# EAGLE design mailboxNotifier (EAGLE 9.4.1)
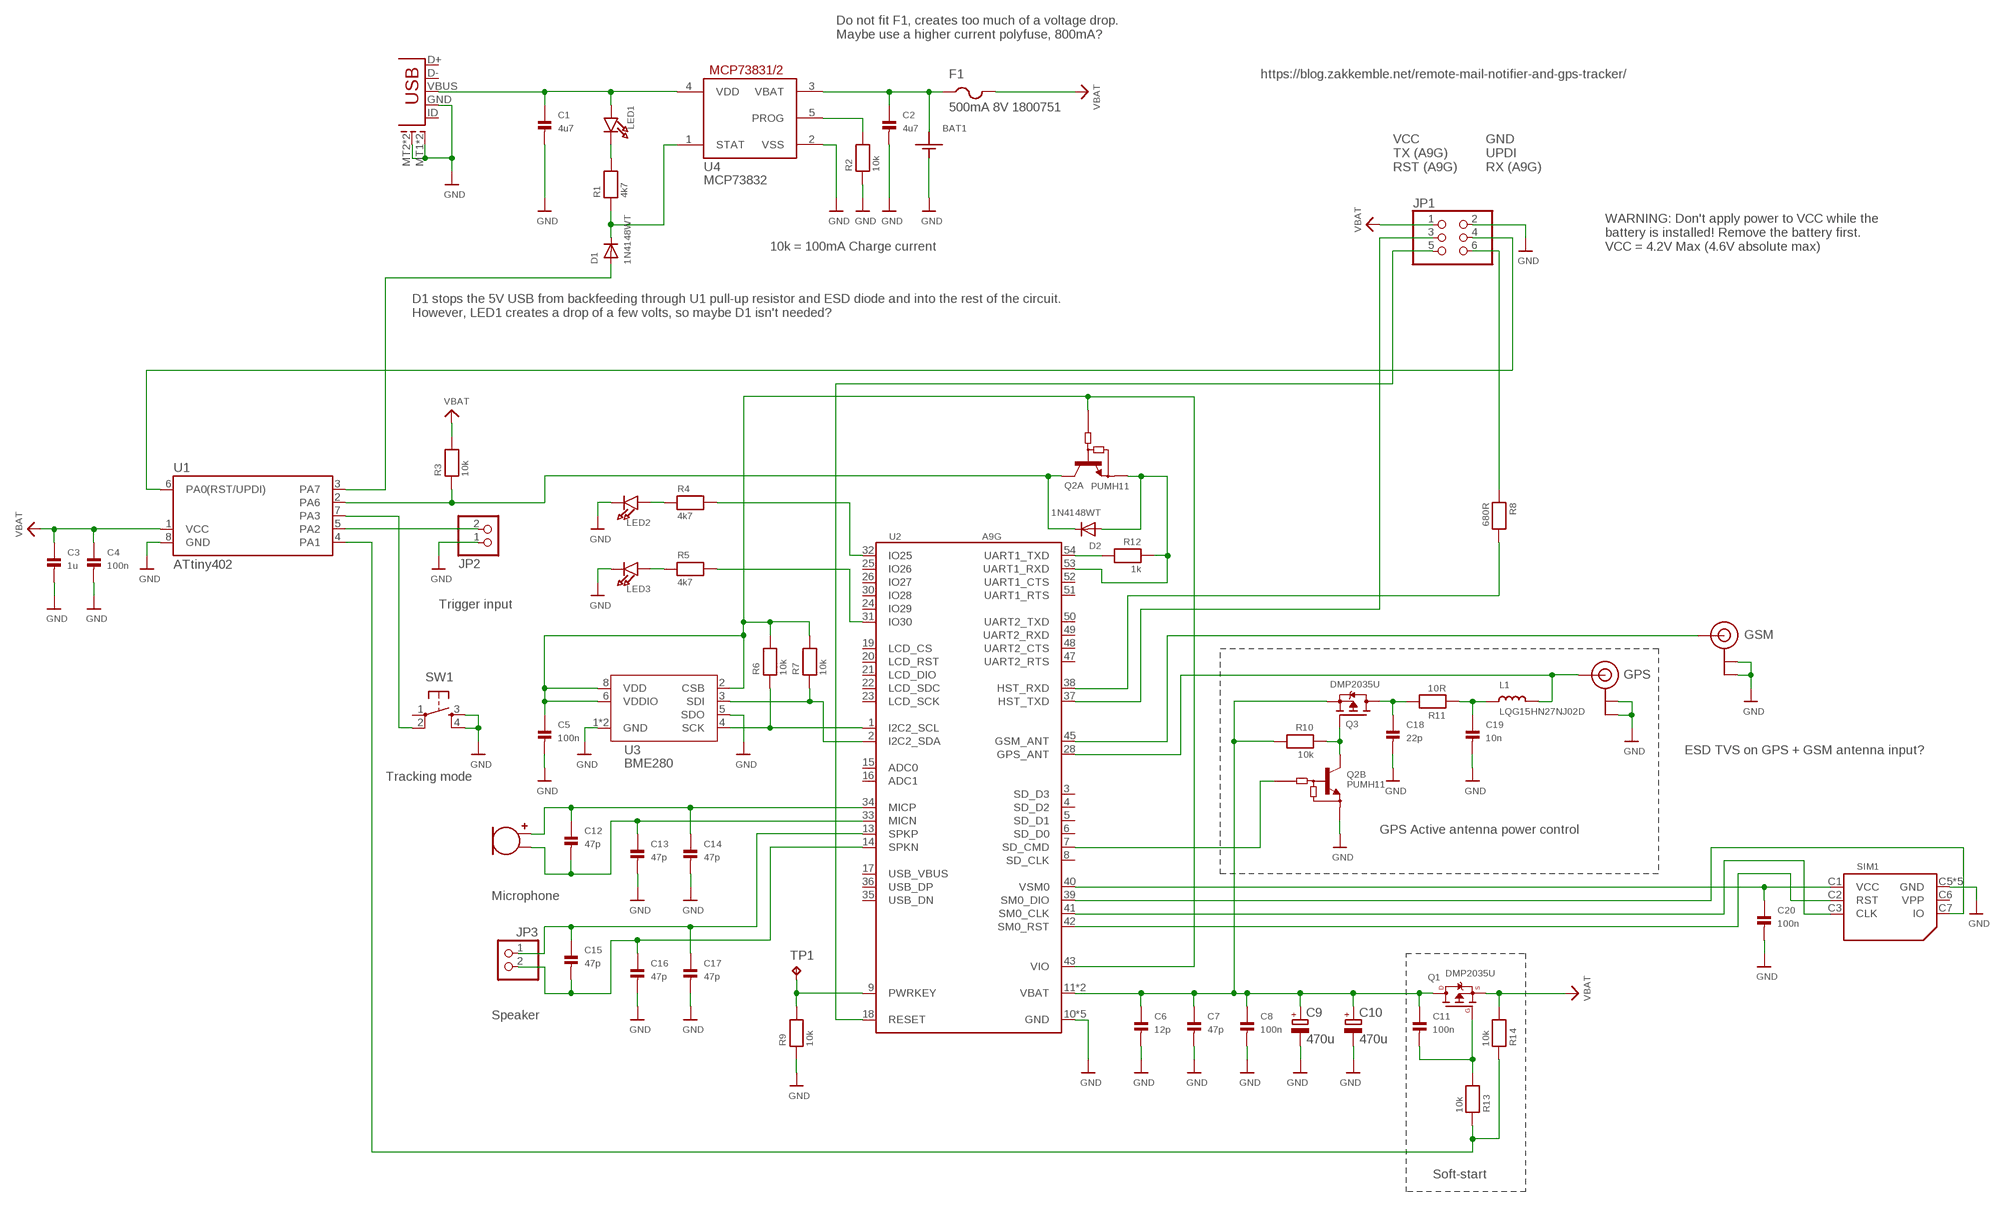
[diagram p0: schematic, sheet 1]

## Parts
BAT1  BATTERY_HOLDER1XAAA_PCB  [BATT_HOLDER_AAA_PCB]
C1  4u7  CAP_CERAMIC0805  [0805_NO_OUTLINE]
C2  4u7  CAP_CERAMIC0805  [0805_NO_OUTLINE]
C3  1u  CAP_CERAMIC_0603MP  [_0603MP]
C4  100n  CAP_CERAMIC0402_SMALL  [0402_SMALL]
C5  100n  CAP_CERAMIC0402_SMALL  [0402_SMALL]
C6  12p  CAP_CERAMIC0402_SMALL  [0402_SMALL]
C7  47p  CAP_CERAMIC0402_SMALL  [0402_SMALL]
C8  100n  CAP_CERAMIC0402_SMALL  [0402_SMALL]
C9  470u  CPOL-EUE2.5-6  [E2,5-6]
C10  470u  CPOL-EUE2.5-6  [E2,5-6]
C11  100n  CAP_CERAMIC0402_SMALL  [0402_SMALL]
C12  47p  CAP_CERAMIC0402_SMALL  [0402_SMALL]
C13  47p  CAP_CERAMIC0402_SMALL  [0402_SMALL]
C14  47p  CAP_CERAMIC0402_SMALL  [0402_SMALL]
C15  47p  CAP_CERAMIC0402_SMALL  [0402_SMALL]
C16  47p  CAP_CERAMIC0402_SMALL  [0402_SMALL]
C17  47p  CAP_CERAMIC0402_SMALL  [0402_SMALL]
C18  22p  CAP_CERAMIC0402_SMALL  [0402_SMALL]
C19  10n  CAP_CERAMIC0402_SMALL  [0402_SMALL]
C20  100n  CAP_CERAMIC0402_SMALL  [0402_SMALL]
D1  1N4148WT  DIODESOD-523  [SOD-523]
D2  1N4148WT  DIODESOD-523  [SOD-523]
F1  500mA 8V 1800751  PTCFUSE1206  [1206]
JP1  PINHD-2X3  [2X03]
JP2  PINHD-1X2/90  [1X02/90]
JP3  PINHD-1X2  [1X02]
L1  LQG15HN27NJ02D  INDUCTOR0402_SMALL  [0402_SMALL]
LED1  LED0603_NOOUTLINE  [CHIPLED_0603_NOOUTLINE]
LED2  LED0603_NOOUTLINE  [CHIPLED_0603_NOOUTLINE]
LED3  LED0603_NOOUTLINE  [CHIPLED_0603_NOOUTLINE]
MIC1  MIC6MM_RA_SWAP  [MIC6MM_RA_SWAP]
Q1  DMP2035U  MOSFET-PSOT-23-WIDE  [SOT-23-WIDE]
Q2  PUMH11  DUAL_NPNDIGITALSOT-363  [SOT-363]
Q3  DMP2035U  MOSFET-P  [SOT23-R]
R1  4k7  RESISTOR0402_SMALL  [0402_SMALL]
R2  10k  RESISTOR0402_SMALL  [0402_SMALL]
R3  10k  RESISTOR0402_SMALL  [0402_SMALL]
R4  4k7  RESISTOR0402_SMALL  [0402_SMALL]
R5  4k7  RESISTOR0402_SMALL  [0402_SMALL]
R6  10k  RESISTOR0402_SMALL  [0402_SMALL]
R7  10k  RESISTOR0402_SMALL  [0402_SMALL]
R8  680R  RESISTOR0402_SMALL  [0402_SMALL]
R9  10k  RESISTOR0402_SMALL  [0402_SMALL]
R10  10k  RESISTOR0402_SMALL  [0402_SMALL]
R11  10R  RESISTOR0402_SMALL  [0402_SMALL]
R12  1k  RESISTOR0402_SMALL  [0402_SMALL]
R13  10k  RESISTOR0402_SMALL  [0402_SMALL]
R14  10k  RESISTOR0402_SMALL  [0402_SMALL]
SIM1  SIMCARDSOCKET  [SIM_SOCKET1]
SW1  SPST_TACTG75_3X4  [TACT_SMD5]
TP1  TPTP10R  [TP10R]
U1  ATtiny402  ATTINY402SOIC8  [SOIC8_150MIL_SMPAD]
U2  A9G  [A9G]
U3  BME280  [BME280]
U4  MCP73831/OT  [SOT23-5L]
U$38  U.FL  [U.FL]
U$55  U.FL  [U.FL]
USB1  USB-MICROBSAFEBEE  [USB-MICROB_SAFEBEE]

## Nets
GND: BAT1.NEG C1.2 C2.2 C3.2 C4.2 C5.2 C6.2 C7.2 C8.2 C9.- C10.- C13.2 C14.2 C16.2 C17.2 C18.2 C19.2 C20.2 JP1.2 JP2.1 LED2.C LED3.C Q2.4(B:E) R2.1 R9.1 SIM1.C5(GND) SIM1.GND1(GND) SIM1.GND2(GND) SIM1.GND3(GND) SIM1.GND4(GND) SW1.3(S) SW1.4(S1) U1.8(GND) U2.10(GND) U2.27(GND) U2.29(GND) U2.44(GND) U2.46(GND) U3.1(GND) U3.5(SDO) U3.7(GND) U4.2(VSS) U$38.1(GND) U$38.2(GND) U$55.1(GND) U$55.2(GND) USB1.GND USB1.MT1(SHEILD1) USB1.MT2(SHEILD2) USB1.MT3(SHEILD1) USB1.MT4(SHEILD2)
N$1: SIM1.C3(CLK) U2.41(SM0_CLK)
N$2: LED1.C R1.2
N$3: SIM1.C2(RST) U2.42(SM0_RST)
N$4: JP1.4 U1.6(PA0(RST/UPDI))
N$5: R2.2 U4.5(PROG)
N$6: JP1.5 U2.18(RESET)
N$7: D2.A Q2.1(A:E) R12.1 U2.53(UART1_RXD)
N$8: R12.2 U2.54(UART1_TXD)
N$9: D1.A U1.3(PA7)
N$10: D2.K(C) Q2.6(A:C) R3.1 U1.2(PA6)
N$11: C5.1 Q2.2(A:B) R6.2 R7.2 U2.43(VIO) U3.2(CSB) U3.6(VDDIO) U3.8(VDD)
N$12: JP2.2 U1.5(PA2)
N$13: C20.1 SIM1.C1(VCC) U2.40(VSM0)
N$14: SW1.2(P1) U1.7(PA3)
N$15: R9.2 TP1.TP U2.9(PWRKEY)
N$16: SIM1.C7(IO) U2.39(SM0_DIO)
N$17: Q2.3(B:C) Q3.1(G) R10.1
N$18: U2.45(GSM_ANT) U$55.3(SIGNAL)
N$19: R4.2 U2.32(IO25)
N$20: R6.1 U2.1(I2C2_SCL) U3.4(SCK)
N$21: R5.2 U2.31(IO30)
N$22: C12.1 C14.1 MIC1.POS U2.34(MICP)
N$23: Q2.5(B:B) U2.7(SD_CMD)
N$24: R8.2 U2.38(HST_RXD)
N$25: R7.1 U2.2(I2C2_SDA) U3.3(SDI)
N$26: JP1.3 U2.37(HST_TXD)
N$27: BAT1.POS C2.1 F1.1 U4.3(VBAT)
N$28: JP1.6 R8.1
N$31: L1.2 U2.28(GPS_ANT) U$38.3(SIGNAL)
N$33: LED3.A R5.1
N$35: C1.1 LED1.A U4.4(VDD) USB1.VBUS
N$40: R13.1 R14.1 U1.4(PA1)
N$41: D1.K(C) R1.1 U4.1(STAT)
N$42: C18.1 Q3.3(D) R11.2
N$44: C19.1 L1.1 R11.1
N$45: C12.2 C13.1 MIC1.NEG U2.33(MICN)
N$48: C15.1 C17.1 JP3.1 U2.13(SPKP)
N$49: LED2.A R4.1
N$50: C11.2 Q1.1(G) R13.2
N$51: C15.2 C16.1 JP3.2 U2.14(SPKN)
N$52: C6.1 C7.1 C8.1 C9.+ C10.+ C11.1 Q1.3(D) Q3.2(S) R10.2 U2.11(VBAT) U2.12(VBAT)
VBAT: C3.1 C4.1 F1.2 JP1.1 Q1.2(S) R3.2 R14.2 U1.1(VCC)
Unconnected: SIM1.C6(VPP) SW1.1(P) U2.3(SD_D3) U2.4(SD_D2) U2.5(SD_D1) U2.6(SD_D0) U2.8(SD_CLK) U2.15(ADC0) U2.16(ADC1) U2.17(USB_VBUS) U2.19(LCD_CS) U2.20(LCD_RST) U2.21(LCD_DIO) U2.22(LCD_SDC) U2.23(LCD_SCK) U2.24(IO29) U2.25(IO26) U2.26(IO27) U2.30(IO28) U2.35(USB_DN) U2.36(USB_DP) U2.47(UART2_RTS) U2.48(UART2_CTS) U2.49(UART2_RXD) U2.50(UART2_TXD) U2.51(UART1_RTS) U2.52(UART1_CTS) USB1.D+ USB1.D- USB1.ID

## Notes on the sheet
- Do not fit F1, creates too much of a voltage drop.
  Maybe use a higher current polyfuse, 800mA?
- https://blog.zakkemble.net/remote-mail-notifier-and-gps-tracker/
- VCC
  TX (A9G)
  RST (A9G)
- GND
  UPDI
  RX (A9G)
- MCP73832
- 10k = 100mA Charge current
- WARNING: Don't apply power to VCC while the
  battery is installed! Remove the battery first.
  VCC = 4.2V Max (4.6V absolute max)
- D1 stops the 5V USB from backfeeding through U1 pull-up resistor and ESD diode and into the rest of the circuit.
  However, LED1 creates a drop of a few volts, so maybe D1 isn't needed?
- Trigger input
- GSM
- GPS
- ESD TVS on GPS + GSM antenna input?
- Tracking mode
- GPS Active antenna power control
- Microphone
- Speaker
- Soft-start

## Library data of the parts
BAT1 = zak:BATTERY_HOLDER
C1 C2 C4-C8 C11-C20 = zak:CAP_CERAMIC
C3 = microbuilder:CAP_CERAMIC: Ceramic Capacitors 0402 - 0402 Surface Mount Capacitors 16pF 50V 5% [Digikey: 445-4899-2-ND] 18pF 50V 5% [Digikey: 490-1281-2-ND] 22pF 50V 5% [Digikey: 490-1283-2-ND] 68pF 50V 5% [Digikey: 490-1289-2-ND] 0.1uF 10V 10% [Digikey: 490-1318-2-ND] 1.0uF 6.3V 10% [Digikey: 490-1320-2-ND] 0603 - 0603 Surface Mount Capacitors 16 pF 50V 5% [Digikey: 445-5051-2-ND] 22 pF 50V [Digikey: PCC220ACVTR-ND] 33 pF 50V 5% [Digikey: 490-1415-1-ND] 56pF 50V 5% [Digikey: 490-1421-1-ND] 220pF 50V 5% [Digikey: 445-1285-1-ND] 680 pF 50V 2200 pF 50V 5% C0G [Digikey: 445-1297-1-ND] 5600 pF 100V 5% X7R [Digikey: 478-3711-1-ND] 0.1 µF 25V 10% [Digikey: PCC2277TR-ND] 0.22 µF 16V 10% X7R [Digikey: 445-1318-1-ND] 1.0 µF 25V 10% [Digikey: 445-5146-2-ND] 0603 - RF Specific 3pF 250V +/-0.1pF RF [Digikey: 712-1347-1-ND] 18 pF 250V 5% [Digikey: 478-3505-1-ND or 712-1322-1-ND] 56 pF 250V 5% C0G RF [Digikey: 490-4867-1-ND] 68 pF 250V RF [Digikey: 490-4868-1-ND] 0805 - 0805 Surface Mount Capacitors 220 pF 250V 2% RF Ceramic Capacitor [Digikey: 712-1398-1-ND] 1000 pF 50V 2% NP0 Ceramic Capacitor [Digikey: 478-3760-1-ND] 0.1 µF 25V 10% Ceramic Capacitor [Digikey: PCC1828TR-ND] 1.0 µF 16V 10% Ceramic Capacitor[Digikey: 490-1691-2-ND] 10.0 µF 10V 10% Ceramic Capacitor[Digikey: 709-1228-1-ND] 10.0 uF 16V 10% Ceramic Capacitor [Digikey: 478-5165-2-ND] 47 uF 6.3V 20% Ceramic Capacitor [Digikey: 587-1779-1-ND or 399-5506-1-ND] 1206 - 1206 Surface Mount Capacitors 47uF 10V 20% Ceramic Capacitor [Digikey: 490-5528-1-ND or 399-5508-1-ND or 445-6010-1-ND] 100uF 6.3V -20%, +80% Y5V Ceramic Capacitor (Digikey: 490-4512-1-ND, Mouser: 81-GRM31CF50J107ZE1L)
C9 C10 = resistor:CPOL-EU: POLARIZED CAPACITOR, European symbol
D1 D2 = zak:DIODE: Diode in 0805 package
F1 = zak:PTCFUSE
JP1 = pinhead:PINHD-2X3: PIN HEADER
JP2 JP3 = pinhead:PINHD-1X2: PIN HEADER
L1 = zak:INDUCTOR
LED1-LED3 = microbuilder:LED: LED 0603 - 0603 Surface Mount Package 2mA: Green LED - Low Power (3.9mcd, 2ma, 1.7Vf) - Digikey: 475-2709-2-ND Orange LED - Low Power (9.8mcd, 2ma, 1.8Vf) - Digikey: 475-1194-2-ND Red LED - Low Power (5mcd, 2ma, 1.8Vf) - Digikey: 475-1195-2-ND Yellow LED - Low Power (7mcd, 2ma, 1.8Vf) - Digikey: 475-1196-2-ND 5mA: Blue LED - Low Power (17mcd, 5ma, 2.9Vf) - Digikey: LNJ937W8CRACT-ND 0805 - 0805 Surface Mount Package 2mA: Red LED (8.8mcd, 2mA, 1.8Vf, Clear) - Low Power [Digikey: 475-2510-1-ND] Green LED (5mcd, 2mA, 1.8Vf, Clear) - Low Power [Digikey: 475-2730-1-ND] Yellow LED (11.3mcd, 2mA, 1.8Vf, Clear) - Low Power [Digikey: 475-2555-1-ND] 20mA: Red LED (104mcd, 20mA, Diffused) - LS R976 [Digikey: 475-1278-6-ND] Red LED (12mcd, 20mA, 2.0Vf, Clear) - APT2012EC [Digikey: 754-1128-1-ND] Green LED (15mcd, 20mA, 2.2Vf, Clear) - APT2012GC [Digikey: 754-1131-1-ND] Orange LED (160mcd, 20mA, 2.1Vf, Clear) - APT2012SECK [Digikey: 754-1130-1-ND] 1206 - 1206 Surface Mount Package Green LED (26mcd, 20mA, Diffused) - LG N971 [Digikey: 475-1407-6-ND] Red LED (15mcd, 20mA, Diffused) - LH N974 [Digikey: 475-1416-6-ND]
MIC1 = zak:MIC
Q1 = zak:MOSFET-P
Q2 = zak:DUAL_NPNDIGITAL
Q3 = microbuilder:MOSFET-P: P-Channel Mosfet LEGEND VDS: Voltage Drain-Source ID: Drain Current RDS(ON): Drain-Source On-State Resistance VGS(TH): Gate-Source Threshold Voltage CISS: Drain-Source Input Capacitance SOT-23 Name VDS ID RDS(ON) VGS(TH) CISS Order Number IRLML5103 30V 760mA 600 mOhm -- 75pF @ 25V Digikey: IRLML5103PBFCT-ND IRLML6401 12V 4.3A 50 mOhm 950mV @ 250µA 830pF @ 10V Digikey: IRLML6401PBFTR-ND NTR0202PL 20V 400mA 800 mOhm 2.3V @ 250uA 70pF @ 5V Digikey: NTR0202PLT1GOSTR-ND NTR4101PT1G 20V 1.8A 85 mOhm 1.2V @ 250uA 675pF @ 10V Digikey: NTR4101PT1GOSCT-ND DMP2004K 20V 600mA 900 mOhm 1V @ 250uA 175pF @ 16V Digikey: DMP2004KDICT-ND PMV65XP 20V 3.9A 76 mOhm 950mV @ 1mA 725pF @ 20V Digikey: 568-2358-2-ND TO-252 Name VDS ID RDS(ON) VGS(TH) CISS Order Number AOD417 30V 25A 34 mOhm 3V @ 250µA 920pF @ 15V Digikey: 785-1106-2-ND
R1-R14 = zak:RESISTOR
SIM1 = zak:SIMCARDSOCKET
SW1 = zak:SPST_TACT
TP1 = testpad:TP: Test pad
U1 = zak:ATTINY402
U2 = zak:A9G
U3 = zak:BME280
U4 = adafruit:MCP73831: MCP73831/2 Miniature Single-Cell, Fully Integrated Li-Ion, Li-Polymer Charge Management Controllers. Nice and small simple lipoly charge controller, with adjustable current and status output (LED) http://www.ladyada.net/library/pcb/eaglelibrary.html
U$38 U$55 = microbuilder:U.FL: U.FL Antenna Connector
USB1 = zak:USB-MICROB

## Board
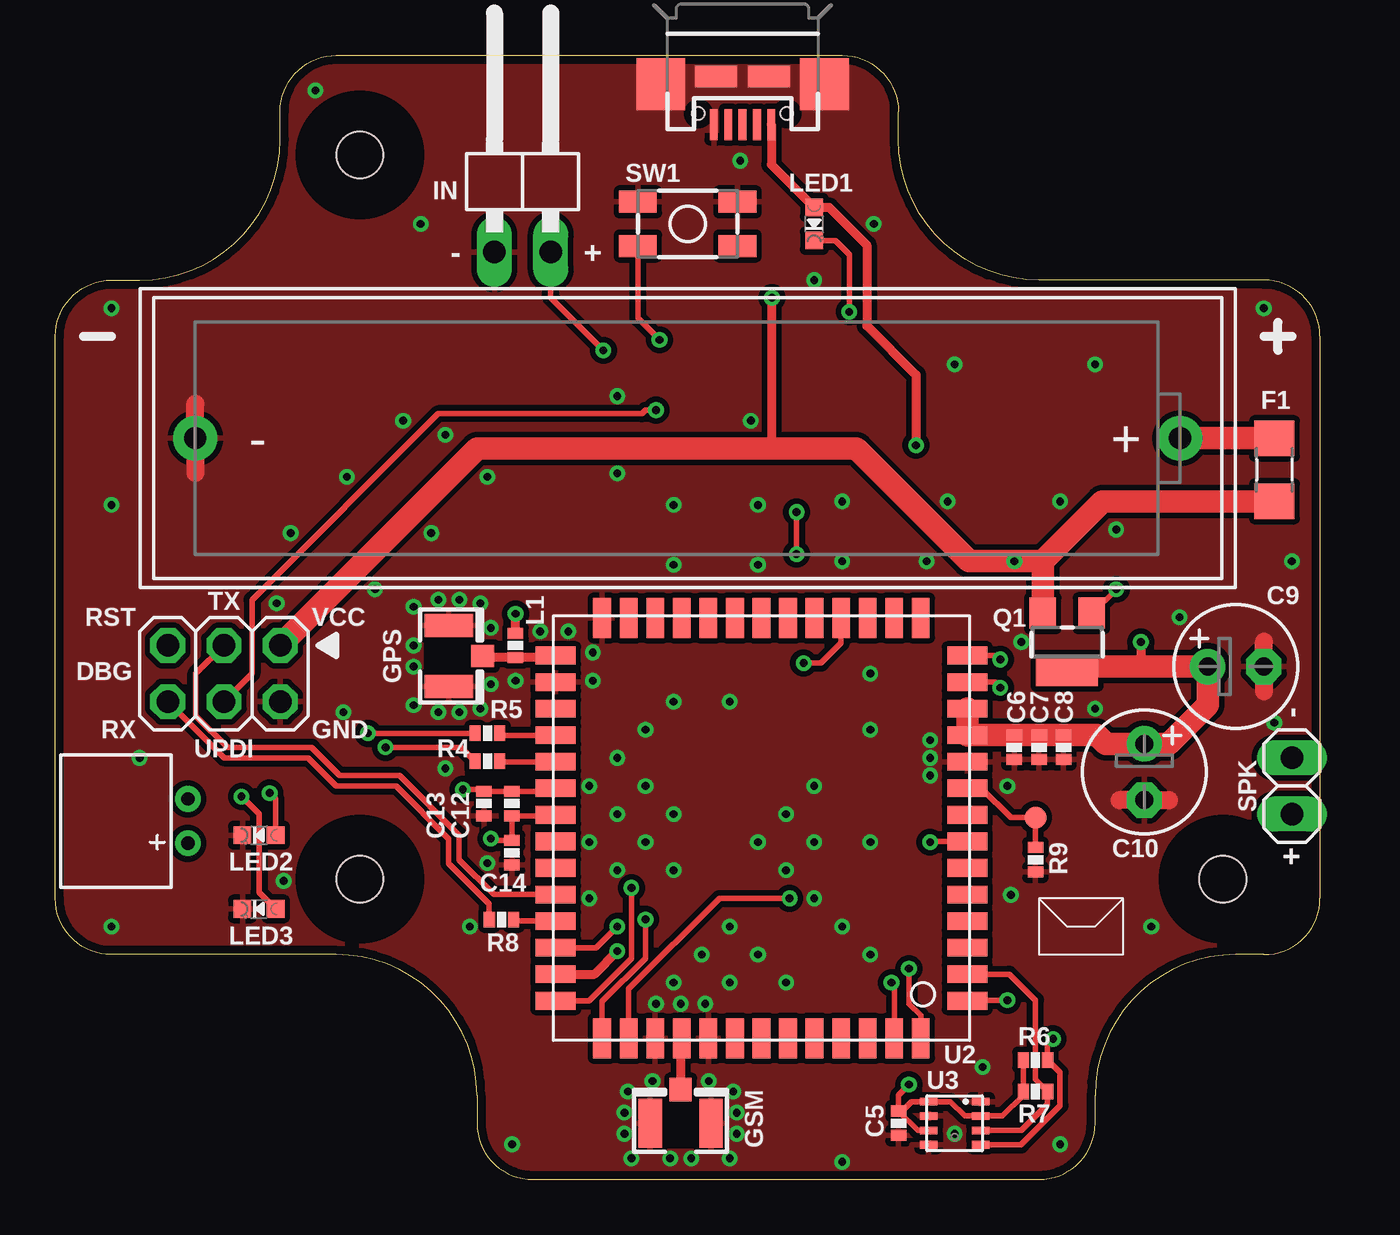
[diagram p1: board, top side]
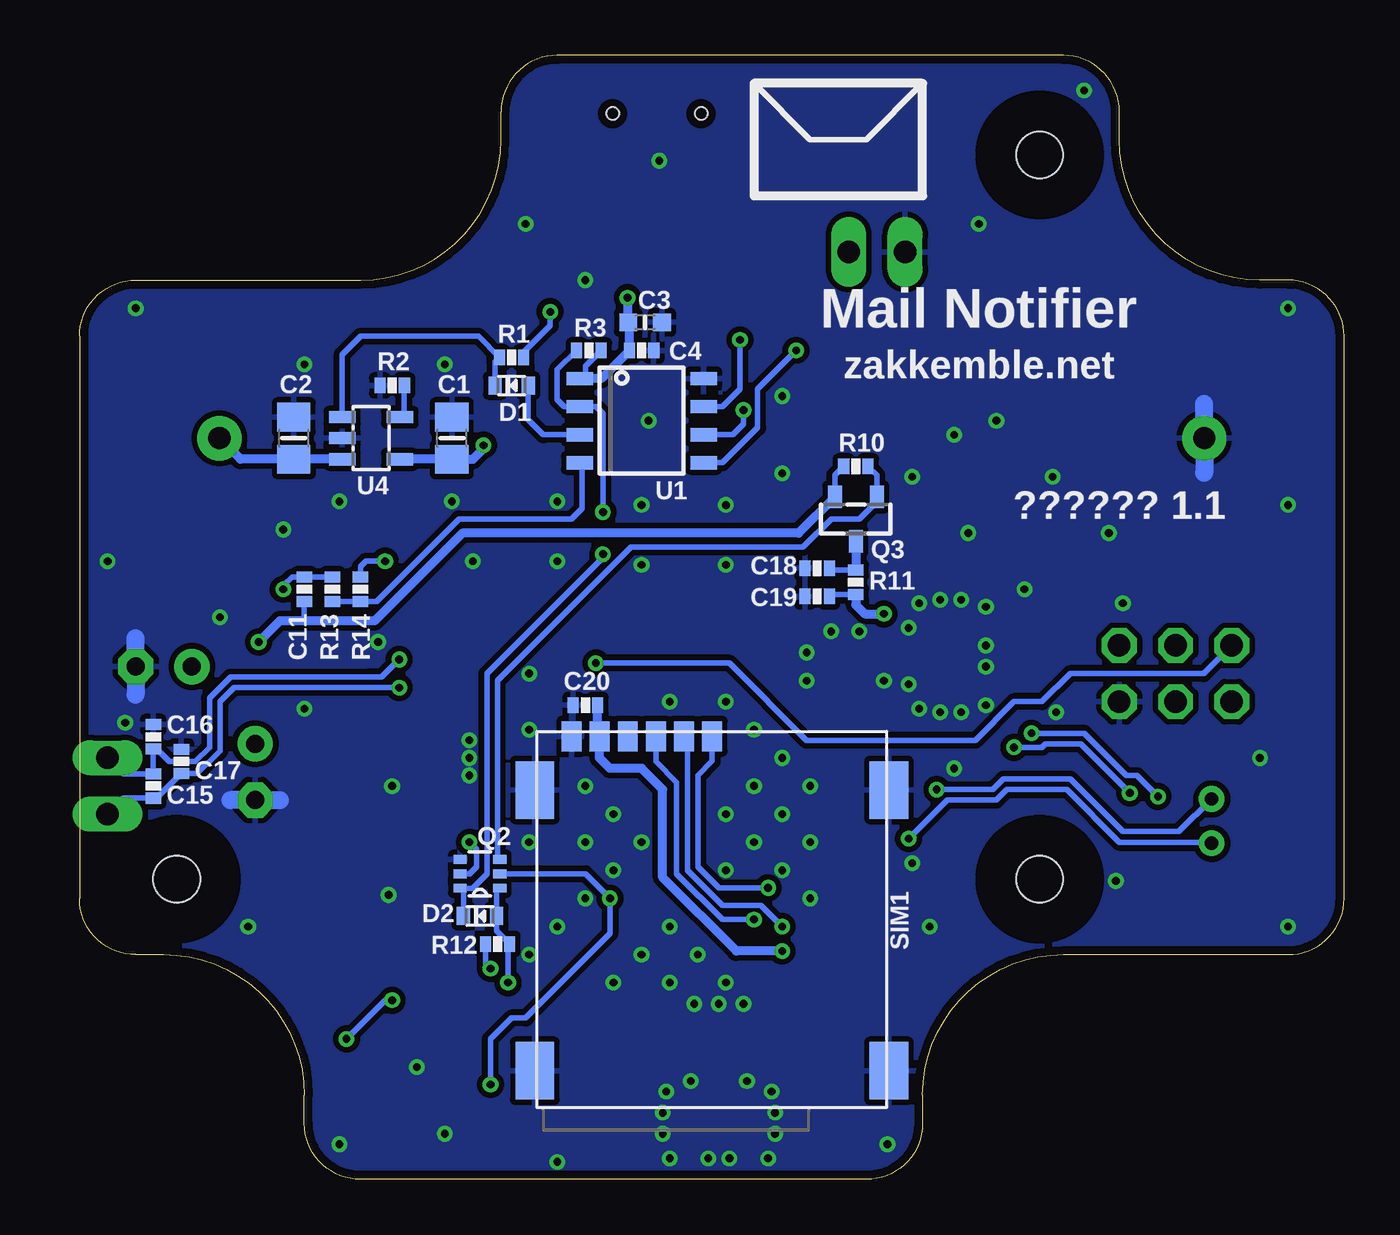
[diagram p2: board, bottom side, seen from below]

Size 57.15 x 50.8 mm. Coordinates in mm from the lower left corner, seen from the top.
Outline: 57.15,38.1 57.15,12.7 arc-90 54.61,10.16 53.34,10.16 arc90 46.99,3.81 46.99,2.54 arc-90 44.45,0 21.59,0 arc-90 19.05,2.54 19.05,3.81 arc90 12.7,10.16 2.54,10.16 arc-90 0,12.7 0,38.1 arc-90 2.54,40.64 3.81,40.64 arc90 10.16,46.99 10.16,48.26 arc-90 12.7,50.8 35.56,50.8 arc-90 38.1,48.26 38.1,46.99 arc90 44.45,40.64 54.61,40.64 arc-90 57.15,38.1
Copper layers (1*16): Top 0.0356mm / dielectric 1.5011mm / Bottom 0.0356mm
Design rules "LaenPCBOrder *": minimum track width 6mil, minimum drill 13mil, track to track 6mil, track to pad 6mil, pad to pad 6mil, via to via 6mil, smd to smd 6mil, copper to edge 15mil, drill to drill 6mil, minimum pad ring 11mil, minimum via ring 7mil, stop-mask expansion 2.5mil, vias tented up to drill 24mil, thermal gap 10mil
Holes 2.1 mm at 13.76,13.57 52.76,13.57 13.76,46.3
bKeepout: area 16.9,23.3 to 21.1,27.5; area 36,23.3 to 40.2,27.5; 2 lines
tRestrict: area 11.2,11 to 16.4,16.2; area 50.2,11 to 55.4,16.2; area 11.2,43.7 to 16.4,48.9
bRestrict: area 11.2,11 to 16.4,16.2; area 50.2,11 to 55.4,16.2; area 11.2,43.7 to 16.4,48.9

### Footprints (pad centres in the part's own frame; a part is rotated, then mirrored left to right if it is on the bottom)
BATT_HOLDER_AAA_PCB = drill 1 pad 2: NEG -22.25,0; POS 22.25,0
0805_NO_OUTLINE = smd 1.3 x 1.5: 1 -0.95,0; 2 0.95,0
_0603MP = smd 0.8 x 0.8: 1 -0.762,0; 2 0.762,0
0402_SMALL = smd 0.5 x 0.7: 1 -0.55,0; 2 0.55,0
E2,5-6 = drill 0.813 pad 1.6: + -1.27,0 | drill 0.813 pad 1.6 octagon: - 1.27,0
SOD-523 = smd 0.8 x 0.6: A 0,-0.75; K 0,0.75
1206 = smd 1.6 x 1.803: 1 -1.422,0; 2 1.422,0
2X03 = drill 1.016 octagon: 1 -2.54,-1.27; 2 -2.54,1.27; 3 0,-1.27; 4 0,1.27; 5 2.54,-1.27; 6 2.54,1.27
1X02/90 = drill 1.016 long: 1 -1.27,-3.81; 2 1.27,-3.81
1X02 = drill 1.016 long: 1 -1.27,0; 2 1.27,0
CHIPLED_0603_NOOUTLINE = smd 0.8 x 0.8: A 0,-0.75; C 0,0.75
MIC6MM_RA_SWAP = drill 0.6: NEG 0.75,1; POS 0.75,-1
SOT-23-WIDE = smd 1.2 x 1.4: 1 -1.1,-1.3; 2 1.1,-1.3 | smd 2.8 x 1.4: 3 0,1.3
SOT-363 = smd 0.6 x 0.4: 1 -0.9,0.65; 2 -0.9,0; 3 -0.9,-0.65; 4 0.9,-0.65; 5 0.9,0; 6 0.9,0.65
SOT23-R = smd 0.635 x 1.016: 1 -0.95,-1; 2 0.95,-1; 3 0,1
SIM_SOCKET1 = smd 0.9 x 1.35: C1 -5.07,8.275; C2 -2.53,8.275; C3 0.01,8.275; C5 -6.34,8.275; C6 -3.8,8.275; C7 -1.26,8.275 | smd 1.75 x 2.6: GND1 -8,5.85; GND2 -8,-6.83; GND3 8,5.85; GND4 8,-6.83
TACT_SMD5 = smd 1.7 x 1: 1 -2.25,1; 2 2.25,1; 3 -2.25,-1; 4 2.25,-1
TP10R = smd 1 x 1: TP 0,0
SOIC8_150MIL_SMPAD = smd 0.6 x 1.2: 1 -1.905,-2.8; 2 -0.635,-2.8; 3 0.635,-2.8; 4 1.905,-2.8; 5 1.905,2.8; 6 0.635,2.8; 7 -0.635,2.8; 8 -1.905,2.8
A9G = smd 1.8 x 0.8: 1 -9.3,7.8; 2 -9.3,6.6; 3 -9.3,5.4; 4 -9.3,4.2; 5 -9.3,3; 6 -9.3,1.8; 7 -9.3,0.6; 8 -9.3,-0.6; 9 -9.3,-1.8; 10 -9.3,-3; 11 -9.3,-4.2; 12 -9.3,-5.4; 13 -9.3,-6.6; 14 -9.3,-7.8; 28 9.3,-7.8; 29 9.3,-6.6; 30 9.3,-5.4; 31 9.3,-4.2; 32 9.3,-3; 33 9.3,-1.8; 34 9.3,-0.6; 35 9.3,0.6; 36 9.3,1.8; 37 9.3,3; 38 9.3,4.2; 39 9.3,5.4; 40 9.3,6.6; 41 9.3,7.8 | smd 0.8 x 1.8: 15 -7.2,-9.5; 16 -6,-9.5; 17 -4.8,-9.5; 18 -3.6,-9.5; 19 -2.4,-9.5; 20 -1.2,-9.5; 21 0,-9.5; 22 1.2,-9.5; 23 2.4,-9.5; 24 3.6,-9.5; 25 4.8,-9.5; 26 6,-9.5; 27 7.2,-9.5; 42 7.2,9.5; 43 6,9.5; 44 4.8,9.5; 45 3.6,9.5; 46 2.4,9.5; 47 1.2,9.5; 48 0,9.5; 49 -1.2,9.5; 50 -2.4,9.5; 51 -3.6,9.5; 52 -4.8,9.5; 53 -6,9.5; 54 -7.2,9.5
BME280 = smd 0.8 x 0.35: 1 1.175,0.975; 2 1.175,0.325; 3 1.175,-0.325; 4 1.175,-0.975; 5 -1.175,-0.975; 6 -1.175,-0.325; 7 -1.175,0.325; 8 -1.175,0.975
SOT23-5L = smd 0.55 x 1.2: 1 -0.95,-1.3; 2 0,-1.3; 3 0.95,-1.3; 4 0.95,1.3; 5 -0.95,1.3
U.FL = smd 2.2 x 1.05: 1 0,1.375; 2 0,-1.375 | smd 1.05 x 1: 3 1.525,0
USB-MICROB_SAFEBEE = smd 0.35 x 1.4: D+ 0,2.65; D- -0.65,2.65; GND 1.3,2.65; ID 0.65,2.65; VBUS -1.3,2.65 | smd 2.2 x 2.35: MT1 -3.7,0.825; MT2 3.7,0.825 | smd 1.9 x 0.95: MT3 -1.2,0.475; MT4 1.2,0.475 | hole 0.55: -2,2.15; 2,2.15

### Placement (x,y rotation side)
BAT1  28.57,33.5 0 top
C1  40.32,33.5 90 bottom
C2  47.47,33.5 90 bottom
C3  31.59,38.73 0 bottom
C4  31.75,37.47 0 bottom
C5  38.1,2.54 270 top
C6  43.34,19.53 270 top
C7  44.45,19.53 270 top
C8  45.56,19.53 270 top
C9  53.34,23.18 0 top
C10  49.21,18.41 270 top
C11  46.99,26.67 90 bottom
C12  20.64,16.99 90 top
C13  19.37,16.99 270 top
C14  20.64,14.76 270 top
C15  53.82,17.78 90 bottom
C16  53.82,20 90 bottom
C17  52.55,18.89 90 bottom
C18  23.81,27.62 180 bottom
C19  23.81,26.35 180 bottom
C20  34.29,21.43 180 bottom
D1  37.62,35.88 90 bottom
D2  39.05,11.91 90 bottom
F1  55.09,32.07 270 top
JP1  7.62,22.86 180 top
JP2  21.11,45.72 0 top
JP3  55.88,17.78 90 top
L1  20.8,24.13 270 top
LED1  34.29,43.18 180 top
LED2  9.21,15.56 90 top
LED3  9.21,12.22 90 top
MIC1  5.24,16.19 0 top
Q1  45.72,24.29 180 top
Q2  39.05,13.81 180 bottom
Q3  22.07,29.85 180 bottom
R1  37.62,37.15 0 bottom
R2  43.02,35.88 0 bottom
R3  34.13,37.47 0 bottom
R4  19.53,18.89 0 top
R5  19.53,20.16 0 top
R6  44.29,5.4 180 top
R7  44.29,3.97 180 top
R8  20.16,11.75 0 top
R9  44.29,14.45 90 top
R10  22.07,32.23 180 bottom
R11  22.07,26.99 90 bottom
R12  38.26,10.64 180 bottom
R13  45.72,26.67 90 bottom
R14  44.45,26.67 90 bottom
SIM1  28.57,11.75 0 bottom
SW1  28.57,43.18 180 top
TP1  44.29,16.35 0 top
U1  31.75,34.29 270 bottom
U2  31.91,15.88 180 top
U3  40.64,2.54 0 top
U4  43.97,33.5 270 bottom
U$38  17.78,23.65 0 top
U$55  28.26,2.54 90 top
USB1  31.05,50.32 180 top

### Tracks (layer width: path | path; a pad name or v marks a point on that pad's centre or on a via)
GND  (via drill 0.35)
  Top 0.813: 54.61,22.07 C9.- 54.61,24.29 | 48.1,17.14 C10.- 50.32,17.14 | 6.33,35.06 BAT1.NEG 6.33,31.93
  Bottom 0.813: 54.61,21.91 C9.- 54.61,24.45 | 48.1,17.14 C10.- 50.32,17.14 | 6.33,35.06 BAT1.NEG 6.33,31.93
  other vias: 29.53,4.45 26.99,4.45 30.64,3.97 30.8,3.02 30.8,2.06 30.48,0.95 27.78,0.95 25.72,2.06 26.03,0.95 25.72,3.02 25.88,3.97 28.73,0.95 19.68,22.38 19.68,24.92 19.21,21.27 18.26,21.11 17.3,21.11 16.19,21.43 16.19,24.13 17.3,26.19 16.19,25.88 18.26,26.19 19.21,26.04 16.19,23.18 21.91,24.77 23.18,24.77 24.29,23.81 24.29,22.54 20.8,22.54 27.15,7.94 29.37,7.94 28.26,7.94 39.53,19.05 39.53,18.26 39.53,19.84 43.02,17.78 2.54,11.43 50.8,25.4 43.18,12.86 2.54,39.37 35.56,0.79 27.94,27.78 35.56,27.94 46.99,21.27 31.75,27.78 39.37,27.94 27.94,30.48 31.75,30.48 35.56,30.64 40.32,30.64 55.88,27.94 40.64,2.06 25.4,35.4 10,26.04 17.62,33.66 19.53,14.29 17.62,18.57 13.02,21.11 19.53,31.75 16.99,29.21 14.45,26.67 13.18,31.75 10.64,29.21 15.72,34.29 25.4,31.91 45.4,30.64 47.94,29.37 54.61,39.37 49.53,11.43 55.09,20.64 43.66,24.29 26.67,15.24 29.21,10.16 35.56,11.43 33.02,16.51 36.83,20.32 3.81,19.05 2.54,30.48 31.43,34.29 34.29,40.64 16.51,43.18 36.99,43.18 30.96,46.04 40.64,36.83 46.99,36.83 45.4,1.59 20.64,1.59 11.75,49.21 18.73,11.43 10.32,13.49 41.91,5.08 26.67,17.78 25.4,16.51 27.94,16.51 25.4,19.05 26.67,20.32 27.94,21.59 24.13,17.78 24.13,15.24 24.13,12.7 25.4,13.97 34.29,15.24 34.29,17.78 34.29,12.7 33.02,13.97 36.83,10.16 33.02,8.89 31.75,10.16 30.48,11.43 30.48,8.89 30.48,21.59 36.83,22.86 36.83,15.24 27.94,8.89 27.94,13.97 31.75,15.24
  pour Top (isolate 0.254, rank 6): 0,0 0,50.8 57.15,50.8 57.15,0
  pour Bottom (isolate 0.254, rank 6): 0,0 0,50.8 57.15,50.8 57.15,0
  pour Top (isolate 0.254, rank 5, no thermals): 25.88,50.8 36.25,50.8 36.25,47.31 25.88,47.31
N$1  (via drill 0.35)
  Top 0.254: U2.41 24.11,8.07 26.03,10 v26.03,13.18
  Bottom 0.254: v26.03,13.18 28.26,13.18 29.21,14.13 29.21,18.26 28.56,18.9 SIM1.C3
N$2  (via drill 0.35)
  Top 0.254: LED1.C 35.24,42.43 35.88,41.8 v35.88,39.21
  Bottom 0.254: v35.88,39.21 35.88,38.58 37.07,37.38 R1.2
N$3  (via drill 0.35)
  Top 0.254: U2.42 24.71,8.04 26.67,10 v26.67,11.75
  Bottom 0.254: v26.67,11.75 28.1,11.75 30.16,13.81 30.16,17.94 31.1,18.88 SIM1.C2
N$4  (via drill 0.35)
  Top 0.254: v27.15,34.77 26.67,34.77 26.51,34.61 17.3,34.61 8.89,26.19 8.89,22.86 JP1.4
  Bottom 0.254: U1.6 27.62,33.66 27.15,34.13 v27.15,34.77
N$5
  Bottom 0.254: U4.5 42.47,34.65 R2.2
N$6  (via drill 0.35)
  Top 0.254: v33.81,23.34 34.61,23.34 35.51,24.24 U2.18
  Bottom 0.254: v33.81,23.34 27.78,23.34 24.29,19.84 16.67,19.84 14.92,21.59 13.65,21.59 12.38,22.86 6.35,22.86 JP1.5
N$7  (via drill 0.35)
  Top 0.254: v37.78,8.89 37.91,8.76 U2.53
  Bottom 0.254: Q2.1 38.3,13.01 D2.A 38.3,11.23 R12.1 37.78,10.56 v37.78,8.89
N$8  (via drill 0.35)
  Top 0.254: v38.58,9.53 38.58,7.94 39.11,7.41 U2.54
  Bottom 0.254: v38.58,9.53 38.81,9.76 R12.2
N$9
  Bottom 0.254: U1.3 36.2,33.66 36.87,34.33 D1.A
N$10  (via drill 0.35)
  Top 0.254: v33.5,30.16 v33.5,28.26
  Bottom 0.254: R3.1 35.56,36.59 35.56,35.24 35.24,34.92 U1.2 33.81,34.92 33.5,34.61 v33.5,30.16 | D2.K 39.8,13.01 Q2.6 39.38,13.16 38.73,13.81 38.73,22.86 33.5,28.1 v33.5,28.26
N$11  (via drill 0.35)
  Top 0.254: U2.43 25.91,8.61 30,12.7 v33.18,12.7 | C5.1 38.26,3.09 38.68,3.52 U3.8 40.46,3.52 41.11,2.87 U3.2 42.8,2.87 43.74,3.81 R7.2 R6.2 | U3.6 38.98,2.21 C5.1 | C5.1 38.1,3.81 v38.58,4.29
  Bottom 0.254: Q2.2 34.29,13.81 v33.18,12.7 33.18,11.11 36.99,7.3 37.62,7.3 38.58,6.35 v38.58,4.29
N$12  (via drill 0.35)
  Top 0.254: JP2.2 22.38,39.85 v24.77,37.47
  Bottom 0.254: U1.5 28.1,32.39 26.51,33.97 26.51,35.72 v24.77,37.47
N$13  (via drill 0.35)
  Top 0.406: U2.40 24.36,9.28 v25.4,10.32
  Bottom 0.406: v25.4,10.32 27.46,10.32 30.8,13.65 30.8,17.62 31.75,18.57 33.18,18.57 33.66,19.05 33.66,20.01 SIM1.C1 33.74,20.12 C20.1
N$14  (via drill 0.35)
  Top 0.254: v27.3,37.94 26.32,38.92 SW1.2
  Bottom 0.254: U1.7 28.1,34.92 27.3,35.72 v27.3,37.94
N$15
  Top 0.254: U2.9 41.86,17.68 43.18,16.35 TP1.TP R9.2
N$16  (via drill 0.35)
  Top 0.254: U2.39 24.45,10.48 v25.4,11.43
  Bottom 0.254: v25.4,11.43 26.35,12.38 28.1,12.38 29.68,13.96 29.68,19.86 SIM1.C7
N$17
  Bottom 0.254: R10.1 21.12,31.83 Q3.1 21.12,30.64 21.91,29.85 23.18,29.85 24.45,28.57 32.23,28.57 38.26,22.54 38.26,14.57 Q2.3
N$18
  Top 0.406: U2.45 28.26,6.32 U$55.3
N$19
  Top 0.254: U2.32 20.09,18.88 R4.2
N$20  (via drill 0.35)
  Top 0.254: U3.4 43.63,1.57 45.4,3.33 45.4,4.84 R6.1 44.84,6.11 v45.09,6.35 | U2.1 41.91,8.07 41.93,8.1 v43.02,8.1
  Bottom 0.254: v45.09,6.35 43.34,8.1 v43.02,8.1
N$21
  Top 0.254: U2.31 20.16,20.07 R5.2
N$22  (via drill 0.35)
  Top 0.254: U2.34 22.57,16.44 C12.1 C14.1 19.77,15.31 v19.68,15.4
  Bottom 0.254: v19.68,15.4 17.94,17.14 15.72,17.14 15.24,17.62 12.54,17.62 10.16,15.24 6.04,15.24 MIC1.POS
N$23  (via drill 0.35)
  Top 0.254: U2.7 39.56,15.28 v39.53,15.24
  Bottom 0.254: Q2.5 39.53,13.81 39.21,14.13 39.21,14.92 v39.53,15.24
N$24
  Top 0.254: U2.38 20.78,11.68 R8.2
N$25
  Top 0.254: U2.2 43.11,9.28 44.29,8.1 44.29,4.52 R7.1 44.84,3.4 43.66,2.21 U3.3
N$26
  Top 0.254: U2.37 19.83,12.88 18.26,14.45 18.26,15.56 15.56,18.26 12.86,18.26 11.59,19.53 7.78,19.53 6.35,20.96 6.35,22.86 JP1.3
N$27
  Top 1.016: BAT1.POS F1.1
  Bottom 0.406: U4.3 C2.1 49.87,32.55 BAT1.POS
N$28
  Top 0.254: JP1.6 7.62,19.05 11.43,19.05 12.7,17.78 15.4,17.78 17.78,15.4 17.78,14.29 19.61,12.46 R8.1
N$31
  Top 0.406: U2.28 22.51,23.58 L1.2 19.38,23.58 U$38.3
N$33  (via drill 0.35)
  Top 0.254: v14.13,20.16 R5.1 | v8.41,17.3 9.21,16.51 9.21,12.97 LED3.A
  Bottom 0.254: v14.13,20.16 11.75,20.16 9.84,18.26 9.37,18.26 v8.41,17.3
N$35  (via drill 0.35)
  Top 0.406: v38.89,33.18 38.89,36.35 36.67,38.58 36.67,42.23 34.97,43.93 LED1.A 32.35,45.86 USB1.VBUS
  Bottom 0.406: U4.4 C1.1 39.37,32.54 38.89,33.02 v38.89,33.18
N$40
  Bottom 0.254: U1.4 34.45,32.28 34.45,30.32 34.92,29.85 40,29.85 43.73,26.12 R14.1 R13.1
N$41
  Bottom 0.254: D1.K 38.37,36.95 R1.1 39.13,38.1 44.45,38.1 45.27,37.28 U4.1
N$42
  Bottom 0.254: R11.2 23.18,27.54 C18.1
  Bottom 0.406: Q3.3 R11.2
N$44  (via drill 0.35)
  Top 0.406: L1.1 v20.8,25.56
  Bottom 0.254: R11.1 23.18,26.44 C19.1
  Bottom 0.406: R11.1 22.07,25.96 21.66,25.56 v20.8,25.56
N$45  (via drill 0.35)
  Top 0.254: U2.33 22.47,17.54 C12.2 C13.1 19.28,17.62 v18.41,17.62
  Bottom 0.254: v18.41,17.62 15.87,17.62 15.4,18.1 12.38,18.1 10,15.72 7.46,15.72 MIC1.NEG
N$48  (via drill 0.35)
  Top 0.254: U2.13 42.45,22.47 v42.7,22.22
  Bottom 0.254: JP3.1 55.16,17.23 C15.1 53.66,17.23 C17.1 51.83,18.34 50.8,19.37 50.8,21.59 50.16,22.22 v42.7,22.22
N$49  (via drill 0.35)
  Top 0.254: v14.92,19.53 18.34,19.53 R4.1 | v9.68,17.46 9.96,17.19 LED2.A
  Bottom 0.254: v14.92,19.53 13.65,19.53 13.49,19.68 11.91,19.68 v9.68,17.46
N$50  (via drill 0.35)
  Top 0.254: Q1.1 46.86,25.59 v47.94,26.67
  Bottom 0.254: R13.2 C11.2 47.55,27.22 47.94,26.83 v47.94,26.67
N$51  (via drill 0.35)
  Top 0.254: U2.14 42.52,23.68 v42.7,23.5
  Bottom 0.254: JP3.2 55.16,18.33 C15.2 C16.1 53.66,19.45 53.1,18.89 51.91,18.89 51.28,19.53 51.28,21.75 50.32,22.7 44.45,22.7 44.13,22.7 43.5,22.7 v42.7,23.5
N$52  (via drill 0.35)
  Top 0.406: v49.05,24.29 49.05,23.18
  Top 1.016: U2.12 U2.11 C6.1 C7.1 C8.1 47.07,20.08 47.47,19.68 C10.+ 50.32,19.68 52.07,21.43 C9.+ 49.05,23.18 45.91,23.18 Q1.3
  Bottom 0.254: Q3.2 23.02,31.83 R10.2 | C11.1 46.99,25.24
  Bottom 0.406: Q3.2 24.65,29.21 39.85,29.21 43.81,25.24 46.99,25.24 48.1,25.24 v49.05,24.29
VBAT  (via drill 0.35)
  Top 0.406: 32.54,33.02 32.38,33.18 v32.38,39.85
  Top 1.016: Q1.2 44.62,27.94 | 44.62,27.94 v43.34,27.94 41.27,27.94 36.2,33.02 32.54,33.02 19.05,33.02 JP1.1 | 44.62,27.94 47.33,30.65 F1.2
  Bottom 0.254: R3.2 34.29,36.76 34.29,36.2 | R14.2 44.45,27.7 44.21,27.94 v43.34,27.94
  Bottom 0.406: U1.1 34.29,36.2 33.57,36.2 C4.1 32.3,38.68 C3.1 32.35,39.81 v32.38,39.85

### Text on the board
tPlace: IN | - | + | RST | TX | VCC | GPS | DBG | - | RX | GND | UPDI | SPK | + | GSM
bPlace: Mail Notifier | zakkemble.net | ?????? 1.1